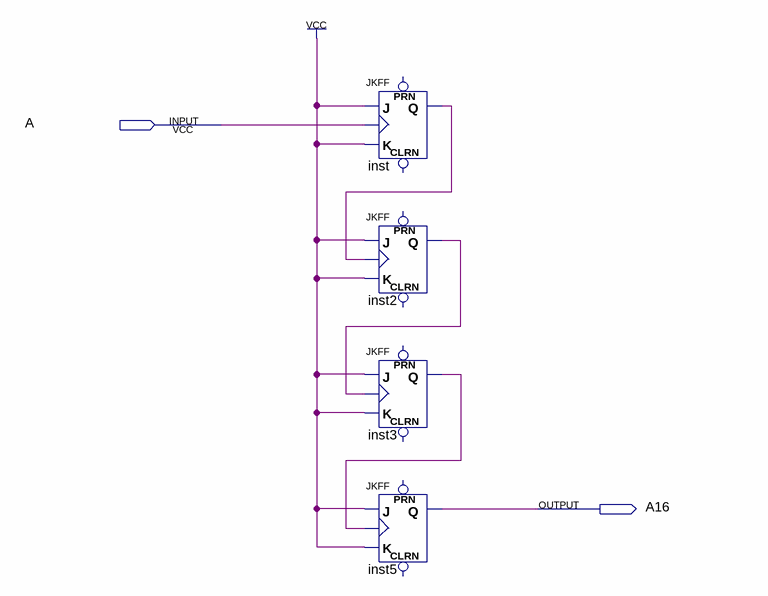
[diagram p0: schematic sheet]
// Quartus schematic divisorf16.bdf as structural Verilog: 4 symbols, 2 pins
module divisorf16 (
  input  A,
  output A16
);

  wire inst2_q, inst3_q, inst_q;

  JKFF inst (.K(1'b1), .J(1'b1), .CLK(A), .Q(inst_q));  // open: PRN, CLRN
  JKFF inst2 (.K(1'b1), .J(1'b1), .CLK(inst_q), .Q(inst2_q));  // open: PRN, CLRN
  JKFF inst3 (.K(1'b1), .J(1'b1), .CLK(inst2_q), .Q(inst3_q));  // open: PRN, CLRN
  JKFF inst5 (.K(1'b1), .J(1'b1), .CLK(inst3_q), .Q(A16));  // open: PRN, CLRN
endmodule
